# Altium schematic sheet CTRL_Connectors.SchDoc
size A4; SheetNumber: 9; SheetTotal: 13
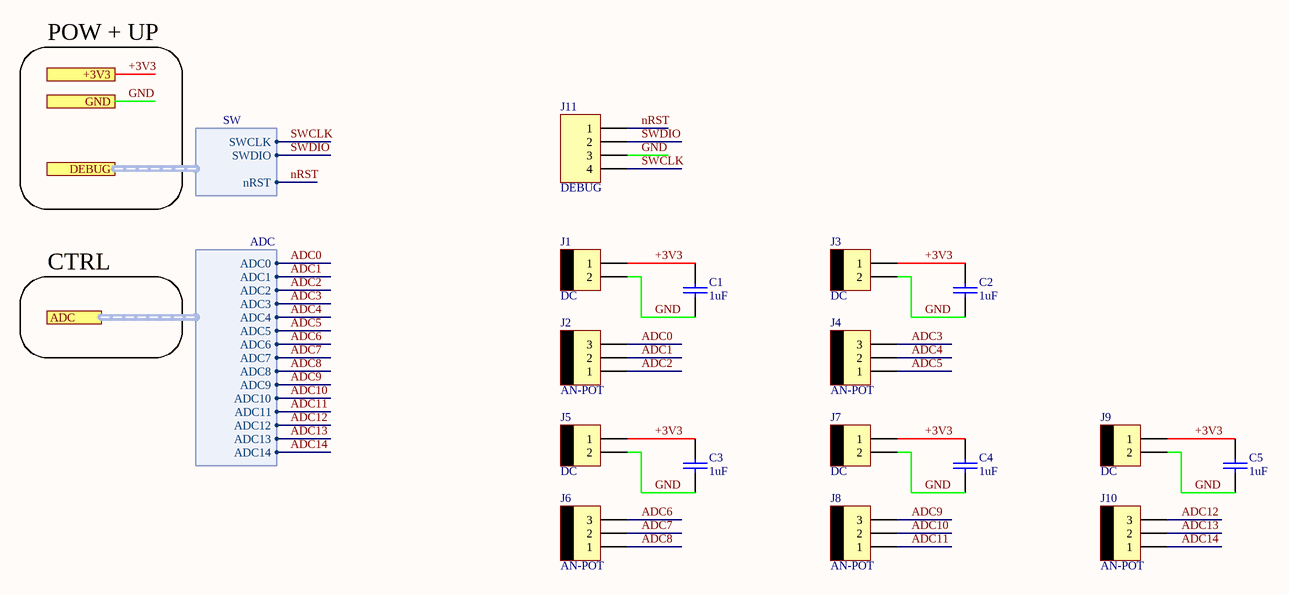
[diagram p0: CTRL_Connectors.SchDoc]

## Parts
C1  1uF  [0603-CAP-TDK]
C2  1uF  [0603-CAP-TDK]
C3  1uF  [0603-CAP-TDK]
C4  1uF  [0603-CAP-TDK]
C5  1uF  [0603-CAP-TDK]
J1  DC  [MOLEX-2]
J2  AN-POT  [MOLEX-3]
J3  DC  [MOLEX-2]
J4  AN-POT  [MOLEX-3]
J5  DC  [MOLEX-2]
J6  AN-POT  [MOLEX-3]
J7  DC  [MOLEX-2]
J8  AN-POT  [MOLEX-3]
J9  DC  [MOLEX-2]
J10  AN-POT  [MOLEX-3]
J11  DEBUG  [SIP1X4]

## Ports
+3V3 (see AudioDSP-v2.0_top[6A], ADC_Block[1A], ADC_Interface[1B], DAC_Block[1B], DSP_Block[1A], MCU_Block[1A], PLL_Block[1A], POW_Block[4B]), ADC (harness ADC, see AudioDSP-v2.0_top[6A], MCU_Block[4C]), DEBUG (harness SW, see AudioDSP-v2.0_top[6A], MCU_Block[1B]), GND (see AudioDSP-v2.0_top[6A], ADC_Block[1B], ADC_Interface[1B], DAC_Block[1B], DSP_Block[1B], IN_Connectors[3A], LPF_Block[1B], LPF_Interface[1B], MCU_Block[1B], OUT_Connectors[3B], PLL_Block[1A], POW_Block[1B])

## Harnesses
SW: SWCLK, SWDIO, nRST
ADC: ADC0, ADC1, ADC2, ADC3, ADC4, ADC5, ADC6, ADC7, ADC8, ADC9, ADC10, ADC11, ADC12, ADC13, ADC14

## Nets
+3V3: C1.2 C2.2 C3.2 C4.2 C5.2 J1.1 J3.1 J5.1 J7.1 J9.1 ; port +3V3
ADC0: J2.3 ; port ADC.ADC0
ADC1: J2.2 ; port ADC.ADC1
ADC2: J2.1 ; port ADC.ADC2
ADC3: J4.3 ; port ADC.ADC3
ADC4: J4.2 ; port ADC.ADC4
ADC5: J4.1 ; port ADC.ADC5
ADC6: J6.3 ; port ADC.ADC6
ADC7: J6.2 ; port ADC.ADC7
ADC8: J6.1 ; port ADC.ADC8
ADC9: J8.3 ; port ADC.ADC9
ADC10: J8.2 ; port ADC.ADC10
ADC11: J8.1 ; port ADC.ADC11
ADC12: J10.3 ; port ADC.ADC12
ADC13: J10.2 ; port ADC.ADC13
ADC14: J10.1 ; port ADC.ADC14
GND: C1.1 C2.1 C3.1 C4.1 C5.1 J1.2 J3.2 J5.2 J7.2 J9.2 J11.3 ; port GND
nRST: J11.1 ; port DEBUG.nRST
SWCLK: J11.4 ; port DEBUG.SWCLK
SWDIO: J11.2 ; port DEBUG.SWDIO

## Notes on the sheet
- POW + UP
- CTRL

## Library data of the parts
C1-C5 = CAP-SMD: JLCPart: C15849
J1 J3 J5 J7 J9 = MOLEX-2
J2 J4 J6 J8 J10 = MOLEX-3
J11 = CON1X4